# Altium schematic sheet Microprocessor Module (328).SchDoc
size A4; SheetNumber: 1; SheetTotal: 1
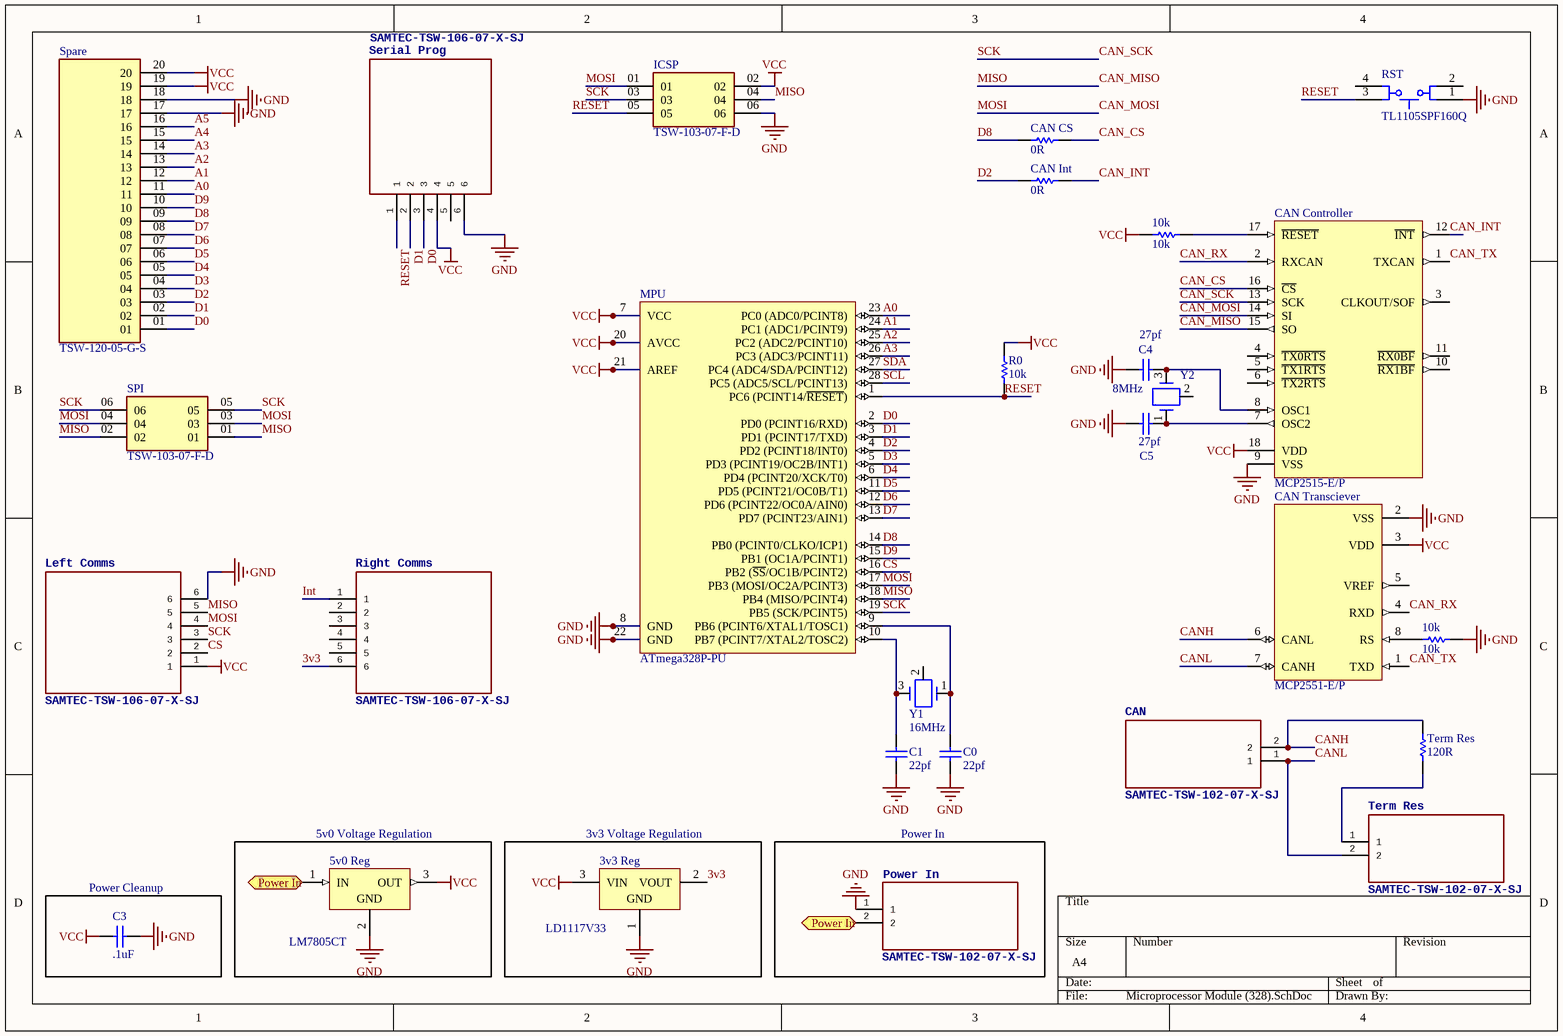
[diagram p0: Microprocessor Module (328).SchDoc]

## Parts
(Parts that share a designator on the sheet are numbered #1, #2 ... from top to bottom, then left to right.)
3v3_Reg  LD1117V33  [STM-TO220-3]
5v0_Reg  LM7805CT  [FAIR-TO-220-3]
10k#1  10k  [VISH-A1-2_V2]
10k#2  10k  [VISH-A1-2_V2]
C0  22pf  [KEMT-C330C105M5U5TA]
C1  22pf  [KEMT-C330C105M5U5TA]
C3  .1uF  [KEMT-C330C105M5U5TA]
C4  27pf  [KEMT-C330C105M5U5TA]
C5  27pf  [KEMT-C330C105M5U5TA]
CAN  SAMTEC-TSW-102-07-X-SJ  [SAMTEC-TSW-102-07-X-S]
CAN_Controller  MCP2515-E/P  [PDIP300-P18]
CAN_CS  0R  [RESC1609X50X30NL8T20]
CAN_Int  0R  [RESC1609X50X30NL8T20]
CAN_Transciever  MCP2551-E/P  [PDIP300-P8]
ICSP  TSW-103-07-F-D  [SAMTEC_TSW-103-07-F-D]
Left_Comms  SAMTEC-TSW-106-07-X-SJ  [SAMTEC-TSW-106-07-X-S]
MPU  ATmega328P-PU  [28P3]
Power_In  SAMTEC-TSW-102-07-X-SJ  [SAMTEC-TSW-102-07-X-S]
R0  10k  [VISH-A1-2_V2]
Right_Comms  SAMTEC-TSW-106-07-X-SJ  [SAMTEC-TSW-106-07-X-S]
RST  TL1105SPF160Q  [ESWI-TL1105SPF_V]
Serial_Prog  SAMTEC-TSW-106-07-X-SJ  [SAMTEC-TSW-106-07-X-S]
Spare  TSW-120-05-G-S  [SAMTEC_TSW-120-05-G-S]
SPI  TSW-103-07-F-D  [SAMTEC_TSW-103-07-F-D]
Term_Res#1  120R  [VISH-A1-2_V2]
Term_Res#2  SAMTEC-TSW-102-07-X-SJ  [SAMTEC-TSW-102-07-X-S]
Y1  16MHz  [ECS-4X-3IL]
Y2  8MHz  [ECS-4X-3IL]

## Blocks framed on the sheet
5v0 Voltage Regulation: 5v0_Reg
3v3 Voltage Regulation: 3v3_Reg
Power In: Power_In
Power Cleanup: C3

## Ports
Power In (bidir, see Microprocessor Module (328)[1D]), Power In (bidir, see Microprocessor Module (328)[3D])

## Nets
GND: 3v3_Reg.1(GND) 5v0_Reg.2(GND) 10k#2.1 C0.1 C1.1 C3.2 C4.2 C5.2 CAN_Controller.9(VSS) CAN_Transciever.2(VSS) ICSP.06 Left_Comms.6 MPU.8(GND) MPU.22(GND) Power_In.1 RST.1 Serial_Prog.6 Spare.17 Spare.18
VCC: 3v3_Reg.3(VIN) 5v0_Reg.3(OUT) 10k#1.2 C3.1 CAN_Controller.18(VDD) CAN_Transciever.3(VDD) ICSP.02 Left_Comms.1 MPU.7(VCC) MPU.20(AVCC) MPU.21(AREF) R0.2 Serial_Prog.4 Spare.19 Spare.20
3v3: 3v3_Reg.2(VOUT) Right_Comms.6
A0: MPU.23(PC0_(ADC0/PCINT8)) Spare.11
A1: MPU.24(PC1_(ADC1/PCINT9)) Spare.12
A2: MPU.25(PC2_(ADC2/PCINT10)) Spare.13
A3: MPU.26(PC3_(ADC3/PCINT11)) Spare.14
A4: Spare.15
A5: Spare.16
CAN_CS: CAN_Controller.16(~{CS}) CAN_CS.2
CAN_INT: CAN_Controller.12(~{INT}) CAN_Int.2
CAN_MISO: CAN_Controller.15(SO) ICSP.04 Left_Comms.5 MPU.18(PB4_(MISO/PCINT4)) SPI.01 SPI.02  [also labelled MISO]
CAN_MOSI: CAN_Controller.14(SI) ICSP.01 Left_Comms.4 MPU.17(PB3_(MOSI/OC2A/PCINT3)) SPI.03 SPI.04  [also labelled MOSI]
CAN_RX: CAN_Controller.2(RXCAN) CAN_Transciever.4(RXD)
CAN_SCK: CAN_Controller.13(SCK) ICSP.03 Left_Comms.3 MPU.19(PB5_(SCK/PCINT5)) SPI.05 SPI.06  [also labelled SCK]
CAN_TX: CAN_Controller.1(TXCAN) CAN_Transciever.1(TXD)
CANH: CAN.2 CAN_Transciever.6(CANL) Term_Res#1.1
CANL: CAN.1 CAN_Transciever.7(CANH) Term_Res#2.2
CS: Left_Comms.2 MPU.16(PB2_(~{SS}/OC1B/PCINT2))
D0: MPU.2(PD0_(PCINT16/RXD)) Serial_Prog.3 Spare.01
D1: MPU.3(PD1_(PCINT17/TXD)) Serial_Prog.2 Spare.02
D2: CAN_Int.1 MPU.4(PD2_(PCINT18/INT0)) Spare.03
D3: MPU.5(PD3_(PCINT19/OC2B/INT1)) Spare.04
D4: MPU.6(PD4_(PCINT20/XCK/T0)) Spare.05
D5: MPU.11(PD5_(PCINT21/OC0B/T1)) Spare.06
D6: MPU.12(PD6_(PCINT22/OC0A/AIN0)) Spare.07
D7: MPU.13(PD7_(PCINT23/AIN1)) Spare.08
D8: CAN_CS.1 MPU.14(PB0_(PCINT0/CLKO/ICP1)) Spare.09
D9: MPU.15(PB1_(OC1A/PCINT1)) Spare.10
Int: Right_Comms.1
Power In: 5v0_Reg.1(IN) Power_In.2 ; port Power In
RESET: ICSP.05 MPU.1(PC6_(PCINT14/~{RESET})) R0.1 RST.3 Serial_Prog.1
SCL: MPU.28(PC5_(ADC5/SCL/PCINT13))
SDA: MPU.27(PC4_(ADC4/SDA/PCINT12))
Net10k#1_1: 10k#1.1 CAN_Controller.17(~{RESET})
Net10k#2_2: 10k#2.2 CAN_Transciever.8(RS)
NetC0_2: C0.2 MPU.9(PB6_(PCINT6/XTAL1/TOSC1)) Y1.1
NetC1_2: C1.2 MPU.10(PB7_(PCINT7/XTAL2/TOSC2)) Y1.3
NetC4_1: C4.1 CAN_Controller.8(OSC1) Y2.3
NetC5_1: C5.1 CAN_Controller.7(OSC2) Y2.1
NetTerm_Res#1_2: Term_Res#1.2 Term_Res#2.1

Not connected (* = marked no-connect by the designer): CAN_Controller 3(CLKOUT/SOF) 4(~{TX0RTS}) 5(~{TX1RTS}) 6(~{TX2RTS}) 10(~{RX1BF}) 11(~{RX0BF}); CAN_Transciever 5(VREF); Right_Comms 2 3 4 5; RST 2 4; Serial_Prog 5; Y1 2; Y2 2

## Library data of the parts
3v3_Reg = CMP-019-00020-2: Low Drop Positive Voltage Regulator, 800 mA, Fixed 3.3 V Output, 0 to 125 degC, 3-Pin TO-220, RoHS, Tube; Manufacturer: STMicroelectronics; Min Supply Voltage: 4.75V; Output Current: 1.3A; Max Ouput Current: 800mA; Max Input Voltage: 15V; Nominal Output Voltage: 3.3V; Dropout Voltage: 1.1V; Outputs: 1; Power: 12W; Min Input Voltage: 4.4V; Min Operating Temperature: 0°C; Pins: 3; Manufacturer URL: http://www.st.com/; Max Operating Temperature: 125°C; Case/Package: TO-220-3; RoHS Compliant: True; Packaging: Rail/Tube; Max Supply Voltage: 15V; Package Quantity: 50; Datasheet Version: Rev. A, 07/2003; Output Voltage: 3.3V; Datasheet URL: http://www.farnell.com/datasheets/1776449.pdf
5v0_Reg = CMP-2000-04938-1: Positive Voltage Regulator, 5 V, 1 A, -40 to 125 degC, 3-Pin TO-220, RoHS, Tube; Manufacturer: FairchildSemiconductor; Maximum Input Voltage: 35V; Maximum Quiescent Current: 8mA; Load Regulation: 100mV; Maximum Output Current: 2.2(Typ)A; Output Type: Fixed; Typical Dropout Voltage @ Current: 2@1AV; Rad Hard: No; Output Voltage: 5V; Accuracy: ±4%; Number of Outputs: 1; Category: LinearRegulator; Package Description: 3-Pin Through Hole Device, Body 10 x 4.5 mm, Pitch 2.54 mm; Packaging: Rail/Tube; Mounting: ThroughHole; Polarity: Positive; Manufacturer URL: https://www.fairchildsemi.com/; Line Regulation: 100mV; Datasheet Version: Aug-12; Datasheet URL: https://datasheet.ciiva.com/26904/lm7805ct-26904988.pdf; Package Reference: TO-220; Package URL: https://www.fairchildsemi.com/package-drawings/TO/TO220B03.pdf; Package: 3TO-220AB; Operating Temperature: -40to125degC; Type: Linear
10k#1 10k#2 R0 Term_Res#1 = CMP-1240-00001-1: Power Metal Film Leaded Resistor, 62 KOhm +/-5%, 2 W, 2-Pin THD, RoHS, Ammo Pack; PartNumber: PR02000206202JA100; Manufacturer: Vishay Semiconductor; Resistance: 62 KOhm; Temperature Coefficient: +/-250 ppm/degC; Power: 2 W; ComponentLink2URL: http://www.vishay.com/docs/28729/28729.pdf; Mounting Technology: Through Hole; Tolerance: +/-5%; ComponentLink3Description: Package Specification; ComponentLink3URL: http://www.vishay.com/docs/28729/28729.pdf; ComponentLink1Description: Manufacturer URL; ComponentLink2Description: Datasheet; DatasheetVersion: Jun-13; PackageDescription: 2-Pin Axial Lead, Body 10 x 3.9 mm; ComponentLink1URL: http://www.vishay.com/; Packing: Ammo Pack; RoHS: TRUE
C0 C1 C3-C5 = CMP-2000-06056-1: Ceramic Capacitor, 1 uF, +/- 20%, 50 V, -10 to 85 degC, 2-Pin THD, RoHS, Bulk; Manufacturer: Kemet; Voltage - Rated: 50V; Temperature Coefficient: Z5U; Catalog Drawings: C330(std); Product Training Modules: CapacitorBasics-TypicalUsesforCapacitors; Capacitance: 1µF; Online Catalog: GoldenMax™Series; Other Names: 399-4390; PCN Design/Specification: C3yySeriesGoldenMaxLeadConfiguration02/Feb/2015; Thickness (Max): -; Size / Dimension: 0.300"Lx0.150"W(7.62mmx3.81mm); Mounting Technology: ThroughHole; Tolerance: ±20%; Mounting Type: ThroughHole; Datasheet URL: http://www.kemet.com/Lists/ProductCatalog/Attachments/599/KEM_C1051_GOLDMAX_Z5U.pdf; Series: GoldenMax™; Standard Package: 250; Ratings: -; Applications: GeneralPurpose; Package Reference: C330C105M5U5TA; Packaging: Bulk; Category: Capacitors; Package Description: 2-Pin Through Hole Device, Body 7.11 x 4.07 mm; Operating Temperature: 10°C~85°C; Height - Seated (Max): 0.360"(9.14mm); Manufacturer URL: http://www.kemet.com/; Lead Spacing: 0.200"(5.08mm); Features: -; Lead Style: Straight; Package / Case: Radial; Family: CeramicCapacitors; Datasheet Version: 12/2015
CAN_Controller = CMP-0186-00008-2: Stand-Alone CAN Controller With SPI Interface, 18-Pin PDIP, Extended Temperature; RevisionNote: URLs added. DatasheetVersion updated.; PackageReference: PDIP300-P18; ComponentLink1Description: Manufacturer URL; ComponentLink1URL: http://www.microchip.com/; Code_JEDEC: MS-001; ComponentLink3URL: http://www.microchip.com/stellent/groups/techpub_sg/documents/packagingspec/en012702.pdf; ComponentLink2Description: Datasheet; PackageDescription: 18-Lead Plastic Dual In-Line (P) - 300 mil Body [PDIP]; ComponentLink3Description: Package Specification; PackageVersion: revBB, Aug-2009; ComponentLink2URL: http://ww1.microchip.com/downloads/en/DeviceDoc/21801f.pdf; DatasheetVersion: revF, Oct-2010
CAN_CS CAN_Int = CMP-2000-03816-5: Chip Resistor, 0 Ohm, Jumper, 100 mW, -55 to 155 degC, 0603 (1608 Metric), RoHS, Tape and Reel; Manufacturer: Vishay Semiconductor; Voltage Rating: 75 V; Package Quantity: 5000; DatasheetVersion: 06/2012; Min Operating Temperature: -55 degC; ComponentLink1URL: http://www.vishay.com/; Mounting Technology: Surface Mount; Height: 0.45 mm; ComponentLink1Description: Manufacturer URL; REACH SVHC: Unknown; PackageReference: 0603; Packaging: Tape and Reel; Max Operating Temperature: 155 degC; Mount: Surface Mount; ComponentLink2Description: Datasheet; PackageDescription: 2-Pin Surface Mount Device, Body 1.575 x 0.85 mm; Length: 1.55 mm; ComponentLink2URL: http://www.vishay.com/docs/20035/dcrcwe3.pdf; Pins: 2; RoHSCompliant: true
CAN_Transciever = CMP-0186-00100-2: High-Speed CAN Transceiver, 8-Pin PDIP, Extended Temperature; PackageReference: PDIP300-P8; DatasheetVersion: revF, Jul-2010; ComponentLink2URL: http://ww1.microchip.com/downloads/en/DeviceDoc/21667F.pdf; ComponentLink2Description: Datasheet; Code_JEDEC: MS-001; ComponentLink1URL: http://www.microchip.com/; RevisionNote: URLs added. DatasheetVersion updated.; PackageVersion: revBB, Aug-2009; ComponentLink3Description: Package Specification; PackageDescription: 8-Lead Plastic Dual In-Line (P) - 300 mil Body [PDIP]; ComponentLink1Description: Manufacturer URL; ComponentLink3URL: http://www.microchip.com/stellent/groups/techpub_sg/documents/packagingspec/en012702.pdf
ICSP SPI = TSW-103-07-F-D: MF: Samtec; Package: None; Availability: Unavailable; Value: *; MP: TSW-103-07-F-D; Price: None
MPU = CMP-0095-00013-2: 8-bit AVR Microcontroller, 32KB Flash, 1KB EEPROM, 2KB SRAM, 28-pin PDIP, Industrial Grade (-40°C to 85°C); RevisionNote: DatasheetVersion updated. URLs added.; PackageVersion: revB, Sep-2001; PackageDescription: 28-lead (0.300"/7.62mm Wide) Plastic Dual Inline Package (PDIP); DatasheetVersion: revD, May-2011; ComponentLink1Description: Manufacturer URL; ComponentLink1URL: http://www.atmel.com/; PackageReference: 28P3; ComponentLink2Description: ATmega48A/48PA/88A/88PA/168A/168PA/328/328P Datasheet; ComponentLink3URL: http://www.atmel.com/dyn/resources/prod_documents/8271S.pdf; ComponentLink2URL: http://www.atmel.com/dyn/resources/prod_documents/8271.pdf; ComponentLink3Description: ATmega48A/48PA/88A/88PA/168A/168PA/328/328P Summary
RST = CMP-2000-07248-1: Tact Switch, SPST-NO, 50 mA, 12 VDC, -20 to 70 degC, 4-Pin THD, RoHS, Bulk; Manufacturer: E-Switch; Actuation Force: 1.6N; Actuator Style: RoundButton; Package URL: http://spec_sheets.e-switch.com/specs/P010201.pdf; Contact Material: Silver; Size: 6x6mm; Manufacturer URL: http://www.e-switch.ch/en/; Datasheet Version: 12/2013; Package Description: 4-Pin Through Hole Device, Body 6 x 6 mm; Datasheet URL: https://www.e-switch.com/system/asset/product_line/data_sheet/140/TL1105.pdf; Termination Style: RightAngle; Package Reference: TL1105SPF; Mounting Technology: ThroughHole
Y1 Y2 = CMP-1669-00002-2: CRYSTAL 8.00 MHZ 20PF 49US; PartNumber: ECS-80-20-4X; Manufacturer: ECS; ComponentLink1URL: http://www.ecsxtal.com/store/pdf/hc-49usx.pdf; ComponentLink1Description: Datasheet; PackageReference: 4X-3IL
Spare = TSW-120-05-G-S: Package: None; Price: None; Value: *; MP: TSW-120-05-G-S; Availability: Unavailable